# EasyEDA schematic SCH_Shell_MotorsportV2.json
TITLE: Shell / Brandbase Car; REV: 1.0; Date: 2022-11-04; Sheet: 1/1; Company: Dan Weaver
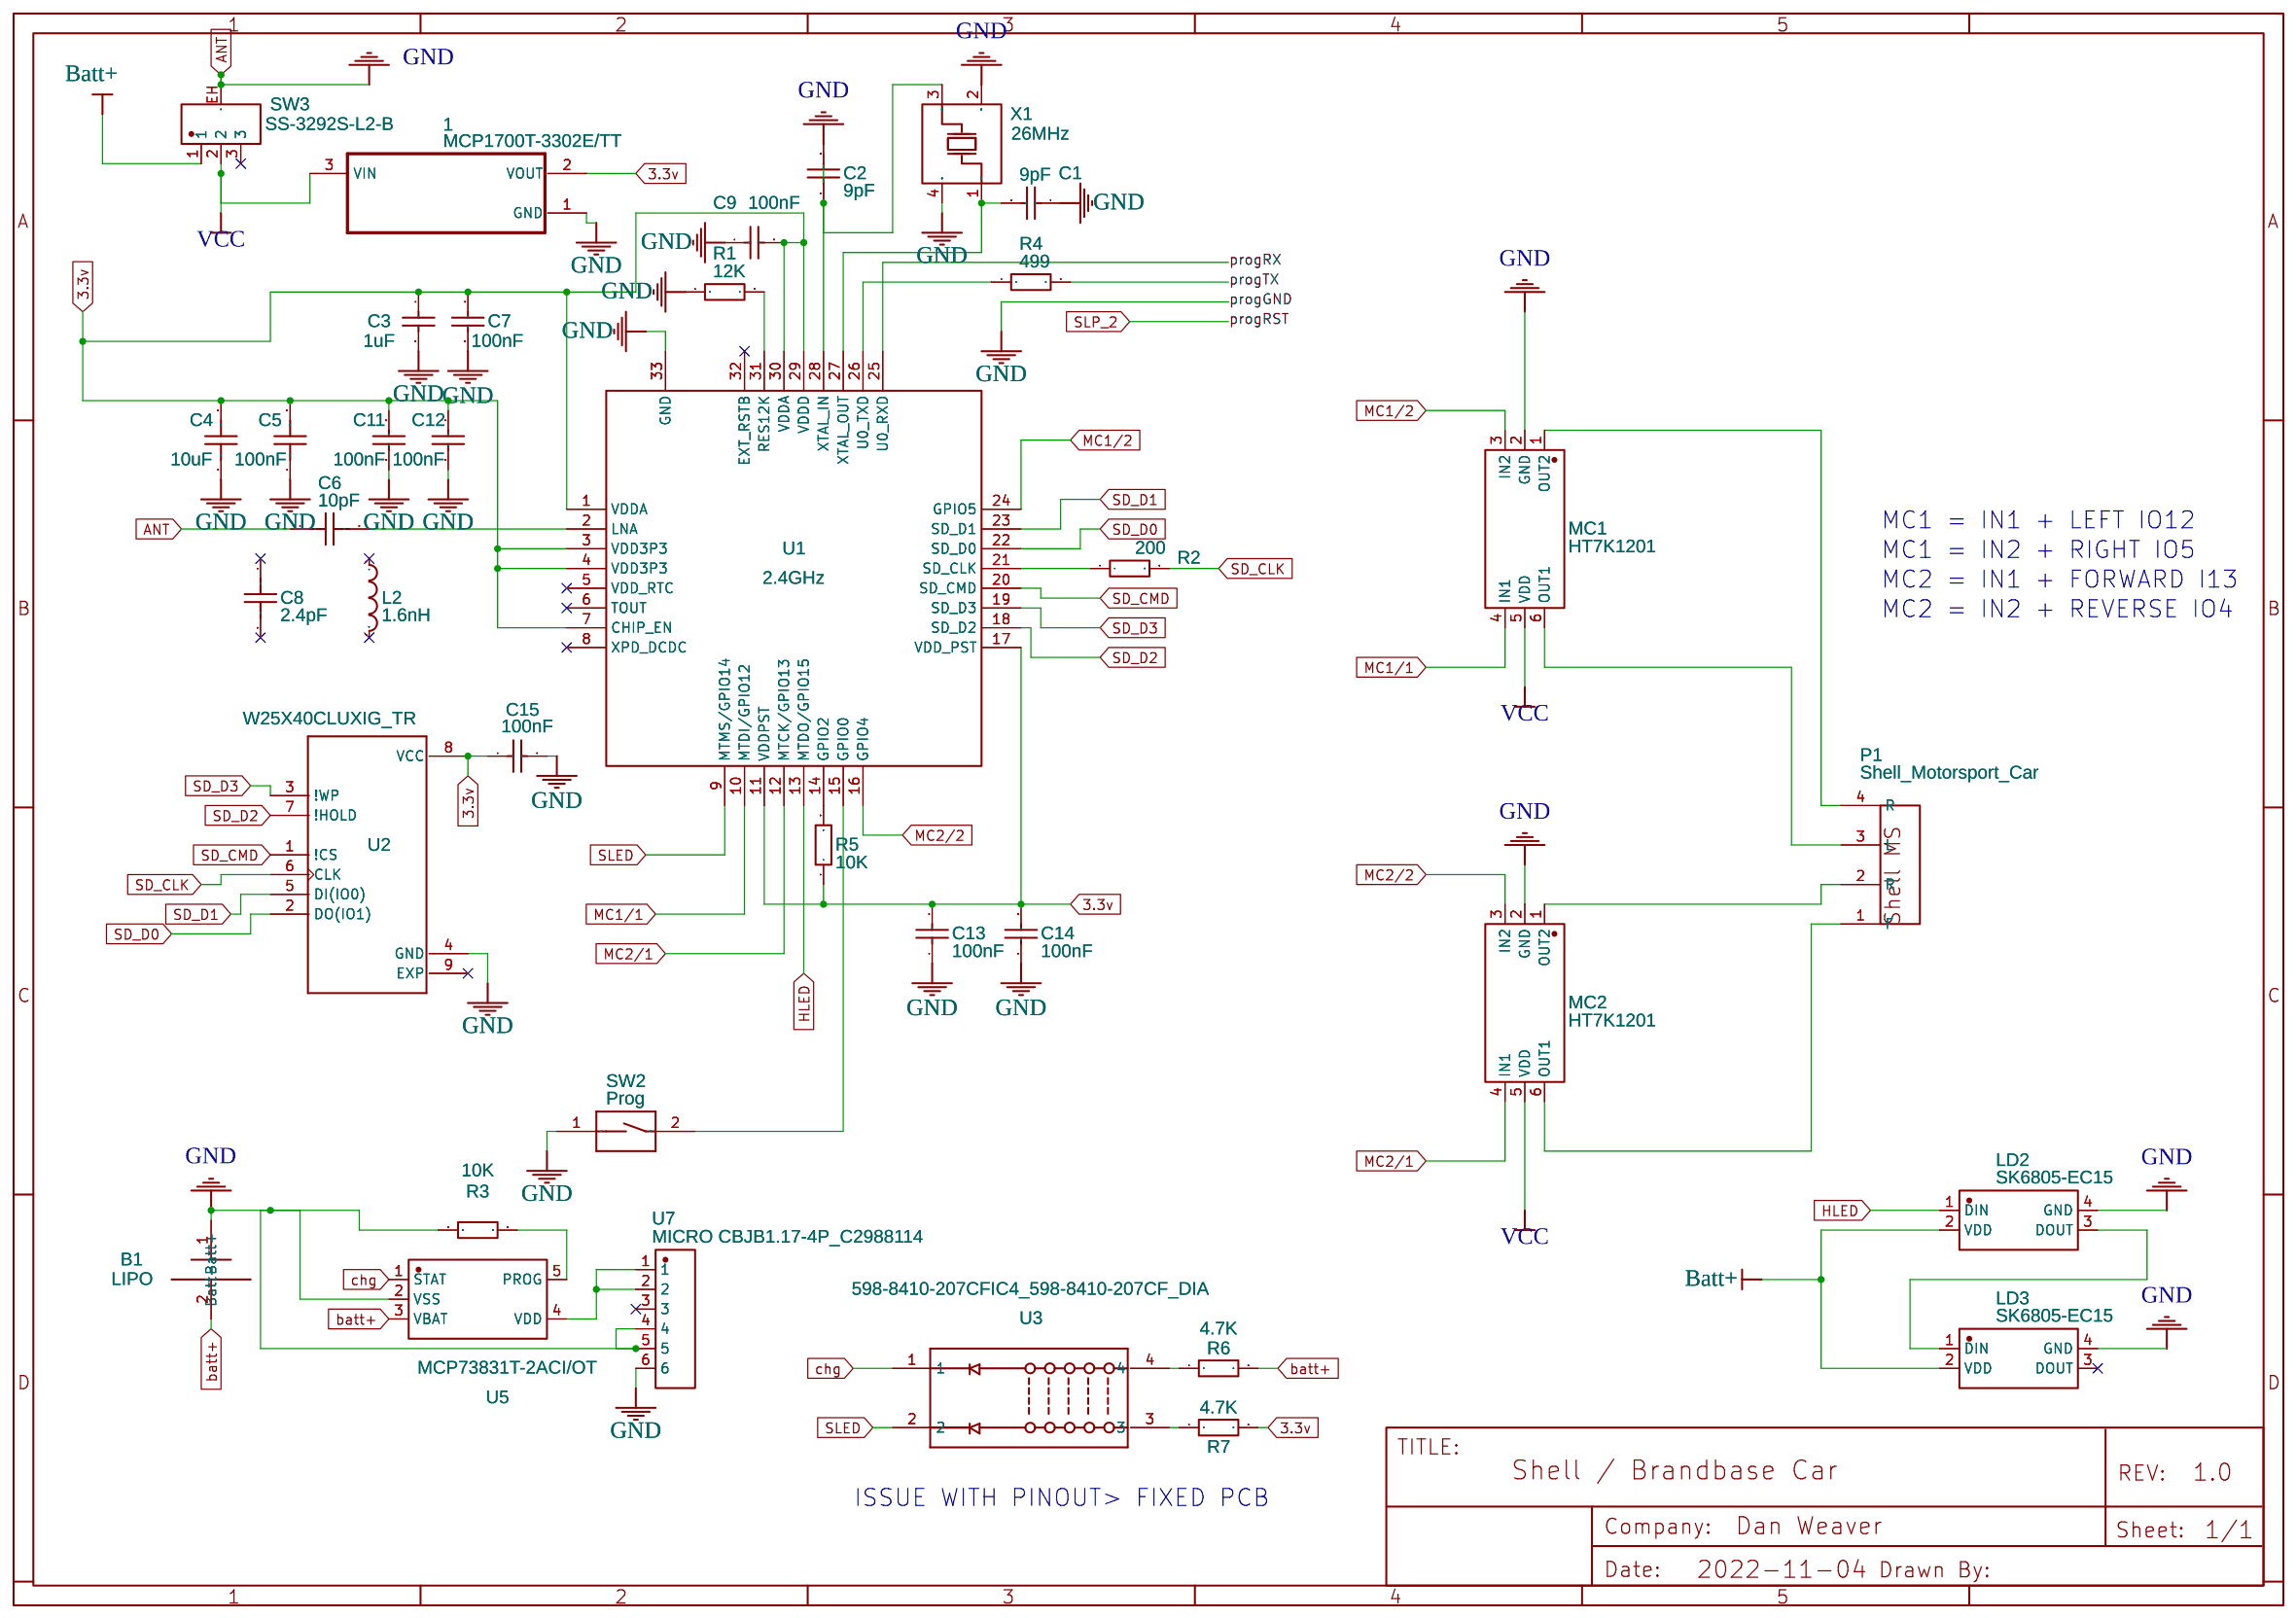
[diagram p0: schematic sheet]

## Parts
1  MCP1700T-3302E/TT  [SOT95P237X112-3N]
B1  LIPO  [LIPO_FOOT]
C1  9pF  [C0402_NEW]
C2  9pF  [C0402_NEW]
C3  1uF  [C0402_NEW]
C4  10uF  [C0402_NEW]
C5  100nF  [C0402_NEW]
C6  10pF  [C0402_NEW]
C7  100nF  [C0402_NEW]
C8  2.4pF  [C0402]
C9  100nF  [C0402_NEW]
C11  100nF  [C0402_NEW]
C12  100nF  [C0402_NEW]
C13  100nF  [C0402_NEW]
C14  100nF  [C0402_NEW]
C15  100nF  [C0402_NEW]
L2  1.6nH  [L0402]
LD2  SK6805-EC15  [LED-SMD_4P-L1.5-W1.5-BL]
LD3  SK6805-EC15  [LED-SMD_4P-L1.5-W1.5-BL]
MC1  HT7K1201  [SOT-23-6_L2.9-W1.6-P0.95-LS2.8-BL]
MC2  HT7K1201  [SOT-23-6_L2.9-W1.6-P0.95-LS2.8-BL]
P1  Shell_Motorsport_Car  [SHELL_MOTORSPORT_FP]
R1  12K  [0402-RES]
R2  200  [0402-RES]
R3  10K  [0402-RES]
R4  499  [0402-RES]
R5  10K  [0402-RES]
R6  4.7K  [0402-RES]
R7  4.7K  [0402-RES]
SW2  Prog  [DIP SWITCH DIP1]
SW3  SS-3292S-L2-B  [SW-SMD_SS-3292S-L2-B]
U1  2.4GHz  [QFN-32_L5.0-W5.0-P0.50-BL-EP3.7]
U2  W25X40CLUXIG_TR  [PSON50P300X200X60-9N]
U3  598-8410-207CFIC4_598-8410-207CF_DIA  [IC4_598-8410-207CF_DIA]
U5  MCP73831T-2ACI/OT  [SOT-23-5_L3.0-W1.7-P0.95-LS2.8-BR]
U7  MICRO CBJB1.17-4P_C2988114  [MINI-USB-SMD_CBJB1.17-4P]
X1  26MHz  [OSC-SMD_4P-L3.2-W2.5-BL]

## Library data of the parts
1 = MCP1700T-3302E/TT: Contributor: Dan Weaver
B1 = LIPO: Contributor: Dan Weaver
C1 C2 = CL05C090DB5NNNC: Supplier: LCSC; Manufacturer: SAMSUNG; Supplier Part: C111805; LCSC Assembly: Yes; SMT Type: Extend
C3 = CL10A105KA8NNNC: Supplier: LCSC; Manufacturer: SAMSUNG; Supplier Part: C5673; LCSC Assembly: Yes; SMT Type: Extend
C4 = CL10A106MA8NRNC: Supplier: LCSC; Manufacturer: SAMSUNG; Supplier Part: C96446; LCSC Assembly: Yes; SMT Type: Extend
C5 = CL10B104KC8NNNC: Supplier: LCSC; Manufacturer: SAMSUNG; Supplier Part: C15725; LCSC Assembly: Yes; SMT Type: Extend
C6 = CL05C100JB5NNNC: Supplier: LCSC; Manufacturer: SAMSUNG; LCSC Assembly: Yes; Supplier Part: C32949; SMT Type: Basic
C7 C9 C11-C15 = CL05B104KO5NNNC: Supplier: LCSC; Manufacturer: SAMSUNG; LCSC Assembly: Yes; Supplier Part: C1525; SMT Type: Basic
C8 = GJM1555C1H2R4CB01D: Supplier: LCSC; Supplier Part: C161317; Manufacturer: Murata Electronics; Contributor: LCSC; LCSC Assembly: Yes; SMT Type: Extend
L2 = MLG1005S1N6BT000: Supplier: LCSC; Manufacturer: TDK; Supplier Part: C87529; LCSC Assembly: Yes; SMT Type: Extend
LD2 LD3 = SK6805-EC15: Supplier: LCSC; Supplier Part: C2890035; Manufacturer: 欧思科光电; JLCPCB Part Class: Extended Part; Contributor: LCSC
MC1 MC2 = HT7K1201: Supplier: LCSC; Supplier Part: C182041; Manufacturer: Holtek Semicon; Contributor: LCSC; JLCPCB Part Class: Extended Part
P1 = Shell_Motorsport_Car: Manufacturer: Brandbase; Contributor: Dan Weaver
R1 R3 R6 R7 = 0402WGF1202TCE: Supplier: LCSC; Manufacturer: UniOhm; LCSC Assembly: Yes; Supplier Part: C25752; SMT Type: Basic
R2 = 0402WGF2000TCE: Supplier: LCSC; Manufacturer: UniOhm; LCSC Assembly: Yes; Supplier Part: C25087; SMT Type: Basic
R4 = 0402WGF4990TCE: Supplier: LCSC; Manufacturer: UniOhm; Supplier Part: C4125; LCSC Assembly: Yes; SMT Type: Extend
R5 = TC0225F1002TCE: Supplier: LCSC; Manufacturer: UniOhm; Supplier Part: C98838; LCSC Assembly: Yes; SMT Type: Extend
SW2 = DIP1: Supplier: Digi-Key; Manufacturer: Omron Electronics Inc-EMC Div; Manufacturer Part: A6TN-1101; Supplier Part: Z12167-ND; Contributor: ahmad902
SW3 = SS-3292S-L2-B: Supplier: LCSC; Supplier Part: C500057; Manufacturer: XKB Enterprise; Contributor: LCSC; JLCPCB Part Class: Extended Part
U1 = ESP8266EX: Supplier: LCSC; Manufacturer: ESPRESSIF; image: //image.lceda.cn/szlcsc/C77967.jpg; Supplier Part: C77967; LCSC Assembly: Yes; SMT Type: Extend
U2 = W25X40CLUXIG_TR: Contributor: Dan Weaver
U3 = 598-8410-207CFIC4_598-8410-207CF_DIA: Contributor: Dan Weaver; Package Display: No
U5 = MCP73831T-2ACI/OT: Supplier: LCSC; Supplier Part: C424093; Manufacturer: Microchip Tech; Contributor: LCSC; JLCPCB Part Class: Extended Part
U7 = MICRO CBJB1.17-4P_C2988114: Supplier: LCSC; Supplier Part: C2988114; Manufacturer: SHOU HAN(首韩); Manufacturer Part: MICRO CBJB1.17-4P; link: https://atta.szlcsc.com/upload/public/pdf/source/20191113/C456009_6088DEFDCAE1BA54F8662987A1BEDE5C.pdf; Contributor: lcsc
X1 = SMD-3225_4P 26MHz 9pF 10ppm -40&#126;+85℃: Supplier: LCSC; Supplier Part: C164056; Manufacturer: Zhejiang Abel Elec; Contributor: LCSC; LCSC Assembly: Yes; SMT Type: Extend

## Nets
3.3v: 1.2(VOUT) C3.1 C4.2 C5.2 C7.2 C9.2 C11.2 C12.2 C13.2 C14.2 C15.1 R5.1 R7.2 U1.1(VDDA) U1.3(VDD3P3) U1.4(VDD3P3) U1.7(CHIP_EN) U1.11(VDDPST) U1.17(VDD_PST) U1.29(VDDD) U1.30(VDDA) U2.8(VCC)
VCC: 1.3(VIN) MC1.5(VDD) MC2.5(VDD) SW3.2
ANT: 1.1(GND) B1.1(Batt-) C1.1 C2.2 C3.2 C4.1 C5.1 C6.1 C7.1 C9.1 C11.1 C12.1 C13.1 C14.1 C15.2 LD2.4(GND) LD3.4(GND) MC1.2(GND) MC2.2(GND) R1.1 R3.1 SW2.1 SW3.EH U1.33(GND) U2.4(GND) U5.2(VSS) U7.4 U7.5 U7.6 X1.2(GND) X1.4(GND)
batt+: B1.2(Batt+) R6.2 U5.3(VBAT)
Batt+: LD2.2(VDD) LD3.2(VDD) SW3.1
chg: U3.1 U5.1(STAT)
HLED: LD2.1(DIN) U1.13(MTDO/GPIO15)
MC1/1: MC1.4(IN1) U1.10(MTDI/GPIO12)
MC1/2: MC1.3(IN2) U1.24(GPIO5)
MC2/1: MC2.4(IN1) U1.12(MTCK/GPIO13)
MC2/2: MC2.3(IN2) U1.16(GPIO4)
progRX: U1.25(U0_RXD)
progTX: R4.2
SD_CLK: R2.2 U2.6(CLK)
SD_CMD: U1.20(SD_CMD) U2.1(!CS)
SD_D0: U1.22(SD_D0) U2.2(DO(IO1))
SD_D1: U1.23(SD_D1) U2.5(DI(IO0))
SD_D2: U1.18(SD_D2) U2.7(!HOLD)
SD_D3: U1.19(SD_D3) U2.3(!WP)
SLED: U1.9(MTMS/GPIO14) U3.2
Net-(C1-2): C1.2 U1.27(XTAL_OUT) X1.1(OSC1)
Net-(C2-1): C2.1 U1.28(XTAL_IN) X1.3(OSC2)
Net-(C6-2): C6.2 U1.2(LNA)
Net-(LD2-3): LD2.3(DOUT) LD3.1(DIN)
Net-(MC1-1): MC1.1(OUT2) P1.4(R)
Net-(MC1-6): MC1.6(OUT1) P1.3(L)
Net-(MC2-1): MC2.1(OUT2) P1.2(R)
Net-(MC2-6): MC2.6(OUT1) P1.1(F)
Net-(R1-2): R1.2 U1.31(RES12K)
Net-(R2-1): R2.1 U1.21(SD_CLK)
Net-(R3-2): R3.2 U5.5(PROG)
Net-(R4-1): R4.1 U1.26(U0_TXD)
Net-(R5-2): R5.2 U1.14(GPIO2)
Net-(R6-1): R6.1 U3.4
Net-(R7-1): R7.1 U3.3
Net-(SW2-2): SW2.2 U1.15(GPIO0)
Net-(U5-4): U5.4(VDD) U7.1 U7.2

Not connected (* = marked no-connect by the designer): C8 1* 2*; L2 1* 2*; LD3 3(DOUT)*; SW3 3*; U1 5(VDD_RTC)* 6(TOUT)* 8(XPD_DCDC)* 32(EXT_RSTB)*; U2 9(EXP)*; U7 3*

## Notes on the sheet
- MC1 = IN1 + LEFT IO12
- MC1 = IN2 + RIGHT IO5
- MC2 = IN1 + FORWARD I13
- MC2 = IN2 + REVERSE IO4
- ISSUE WITH PINOUT> FIXED PCB
